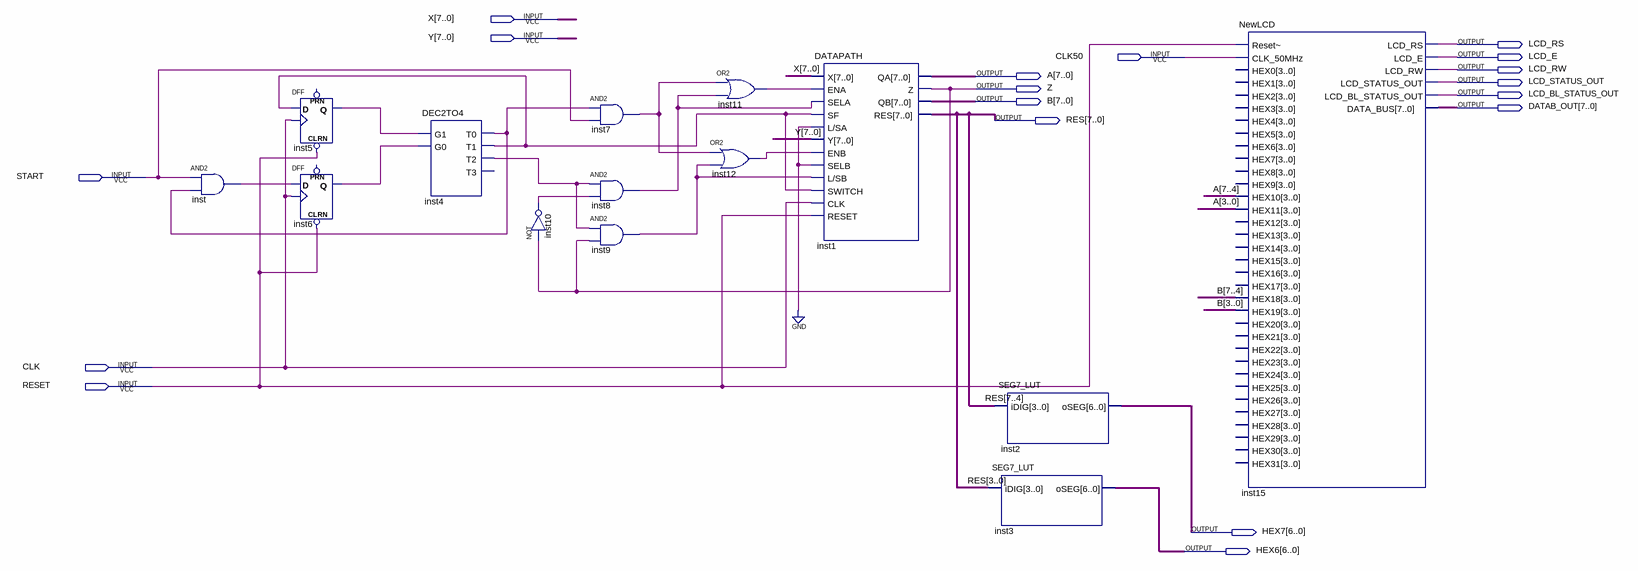
[diagram p0: schematic sheet]
// Quartus schematic Exercise4.bdf as structural Verilog: 14 symbols, 18 pins
module Exercise4 (
  input  [7:0] X,
  input  [7:0] Y,
  input  CLK50,
  input  START,
  input  CLK,
  input  RESET,
  output LCD_RS,
  output LCD_E,
  output LCD_RW,
  output [7:0] A,
  output LCD_STATUS_OUT,
  output Z,
  output LCD_BL_STATUS_OUT,
  output [7:0] B,
  output [7:0] DATAB_OUT,
  output [7:0] RES,
  output [6:0] HEX7,
  output [6:0] HEX6
);

  wire inst4_t0, inst4_t1, inst4_t2, inst5_q, inst6_q, inst7_out, inst8_out, inst9_out, inst10_out,
       inst11_out, inst12_out, inst_out;

  and inst (inst_out, START, inst4_t0);
  DFF inst5 (.CLRN(RESET), .CLK(CLK), .D(inst4_t1), .Q(inst5_q));  // open: PRN
  DFF inst6 (.CLRN(RESET), .CLK(CLK), .D(inst_out), .Q(inst6_q));  // open: PRN
  DEC2TO4 inst4 (.G1(inst5_q), .G0(inst6_q), .T0(inst4_t0), .T1(inst4_t1), .T2(inst4_t2));  // open: T3
  not inst10 (inst10_out, Z);
  and inst7 (inst7_out, inst4_t0, START);
  and inst8 (inst8_out, inst4_t2, inst10_out);
  and inst9 (inst9_out, inst4_t2, Z);
  or inst11 (inst11_out, inst7_out, inst8_out);
  or inst12 (inst12_out, inst7_out, inst9_out);
  DATAPATH inst1 (
    .X(X), .ENA(inst11_out), .SELA(inst8_out), .SF(inst4_t1), .\L/SA (1'b0), .Y(Y), .ENB(inst12_out),
    .SELB(1'b0), .\L/SB (inst9_out), .SWITCH(inst4_t1), .CLK(CLK), .RESET(RESET), .QA(A), .Z(Z), .QB(B),
    .RES(RES));
  SEG7_LUT inst2 (.iDIG(RES[7:4]), .oSEG(HEX7));
  SEG7_LUT inst3 (.iDIG(RES[3:0]), .oSEG(HEX6));
  NewLCD inst15 (
    .\Reset~ (RESET), .CLK_50MHz(CLK50), .HEX10(A[7:4]), .HEX11(A[3:0]), .HEX18(B[7:4]), .HEX19(B[3:0]),
    .LCD_RS(LCD_RS), .LCD_E(LCD_E), .LCD_RW(LCD_RW), .LCD_STATUS_OUT(LCD_STATUS_OUT),
    .LCD_BL_STATUS_OUT(LCD_BL_STATUS_OUT), .DATA_BUS(DATAB_OUT));  // open: HEX0, HEX1, HEX2, HEX3, HEX4, HEX5, HEX6, HEX7, HEX8, HEX9, HEX12, HEX13, HEX14, HEX15, HEX16, HEX17, HEX20, HEX21, HEX22, HEX23, HEX24, HEX25, HEX26, HEX27, HEX28, HEX29, HEX30, HEX31
endmodule
